# Altium project TTN_Gateway_V2.3.1.PrjPcb (part 2 of 2)

## Sheet processing.SchDoc: Processing
size A2 portrait; Organization: Tweetonig; Address1: Delftsestraat 11; DocumentNumber: 6; Revision: 1.0; SheetNumber: 6; SheetTotal: 9
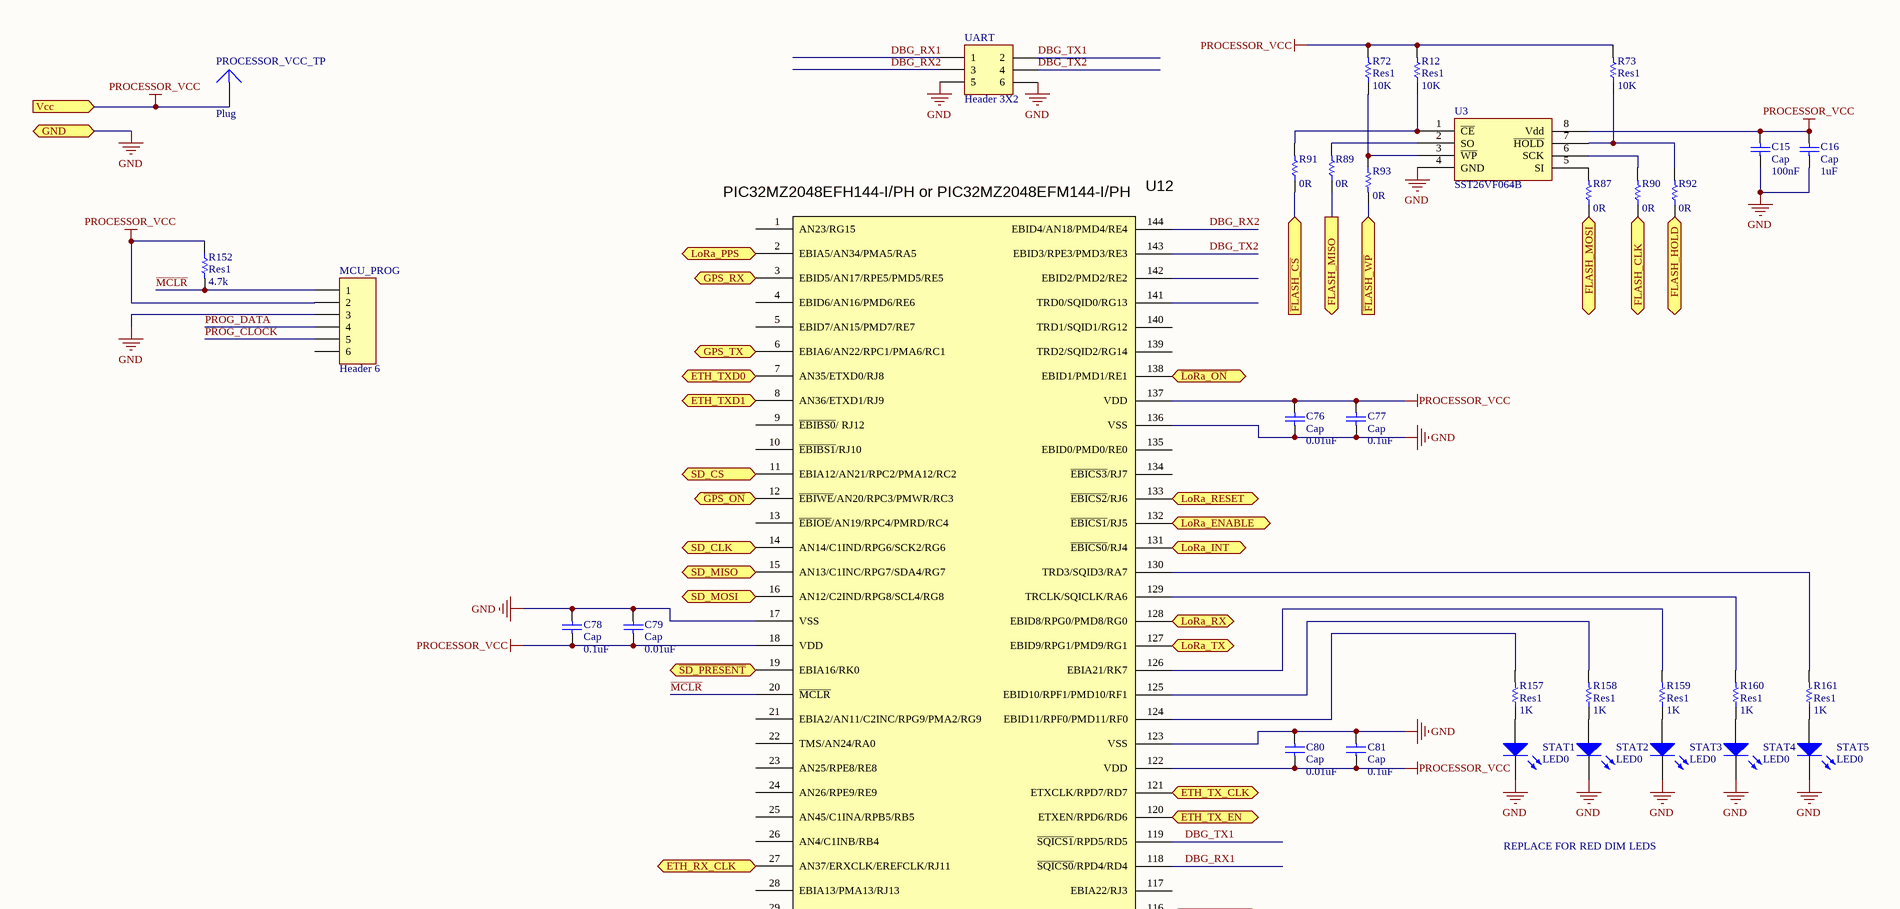
[diagram p7: processing.SchDoc, top]
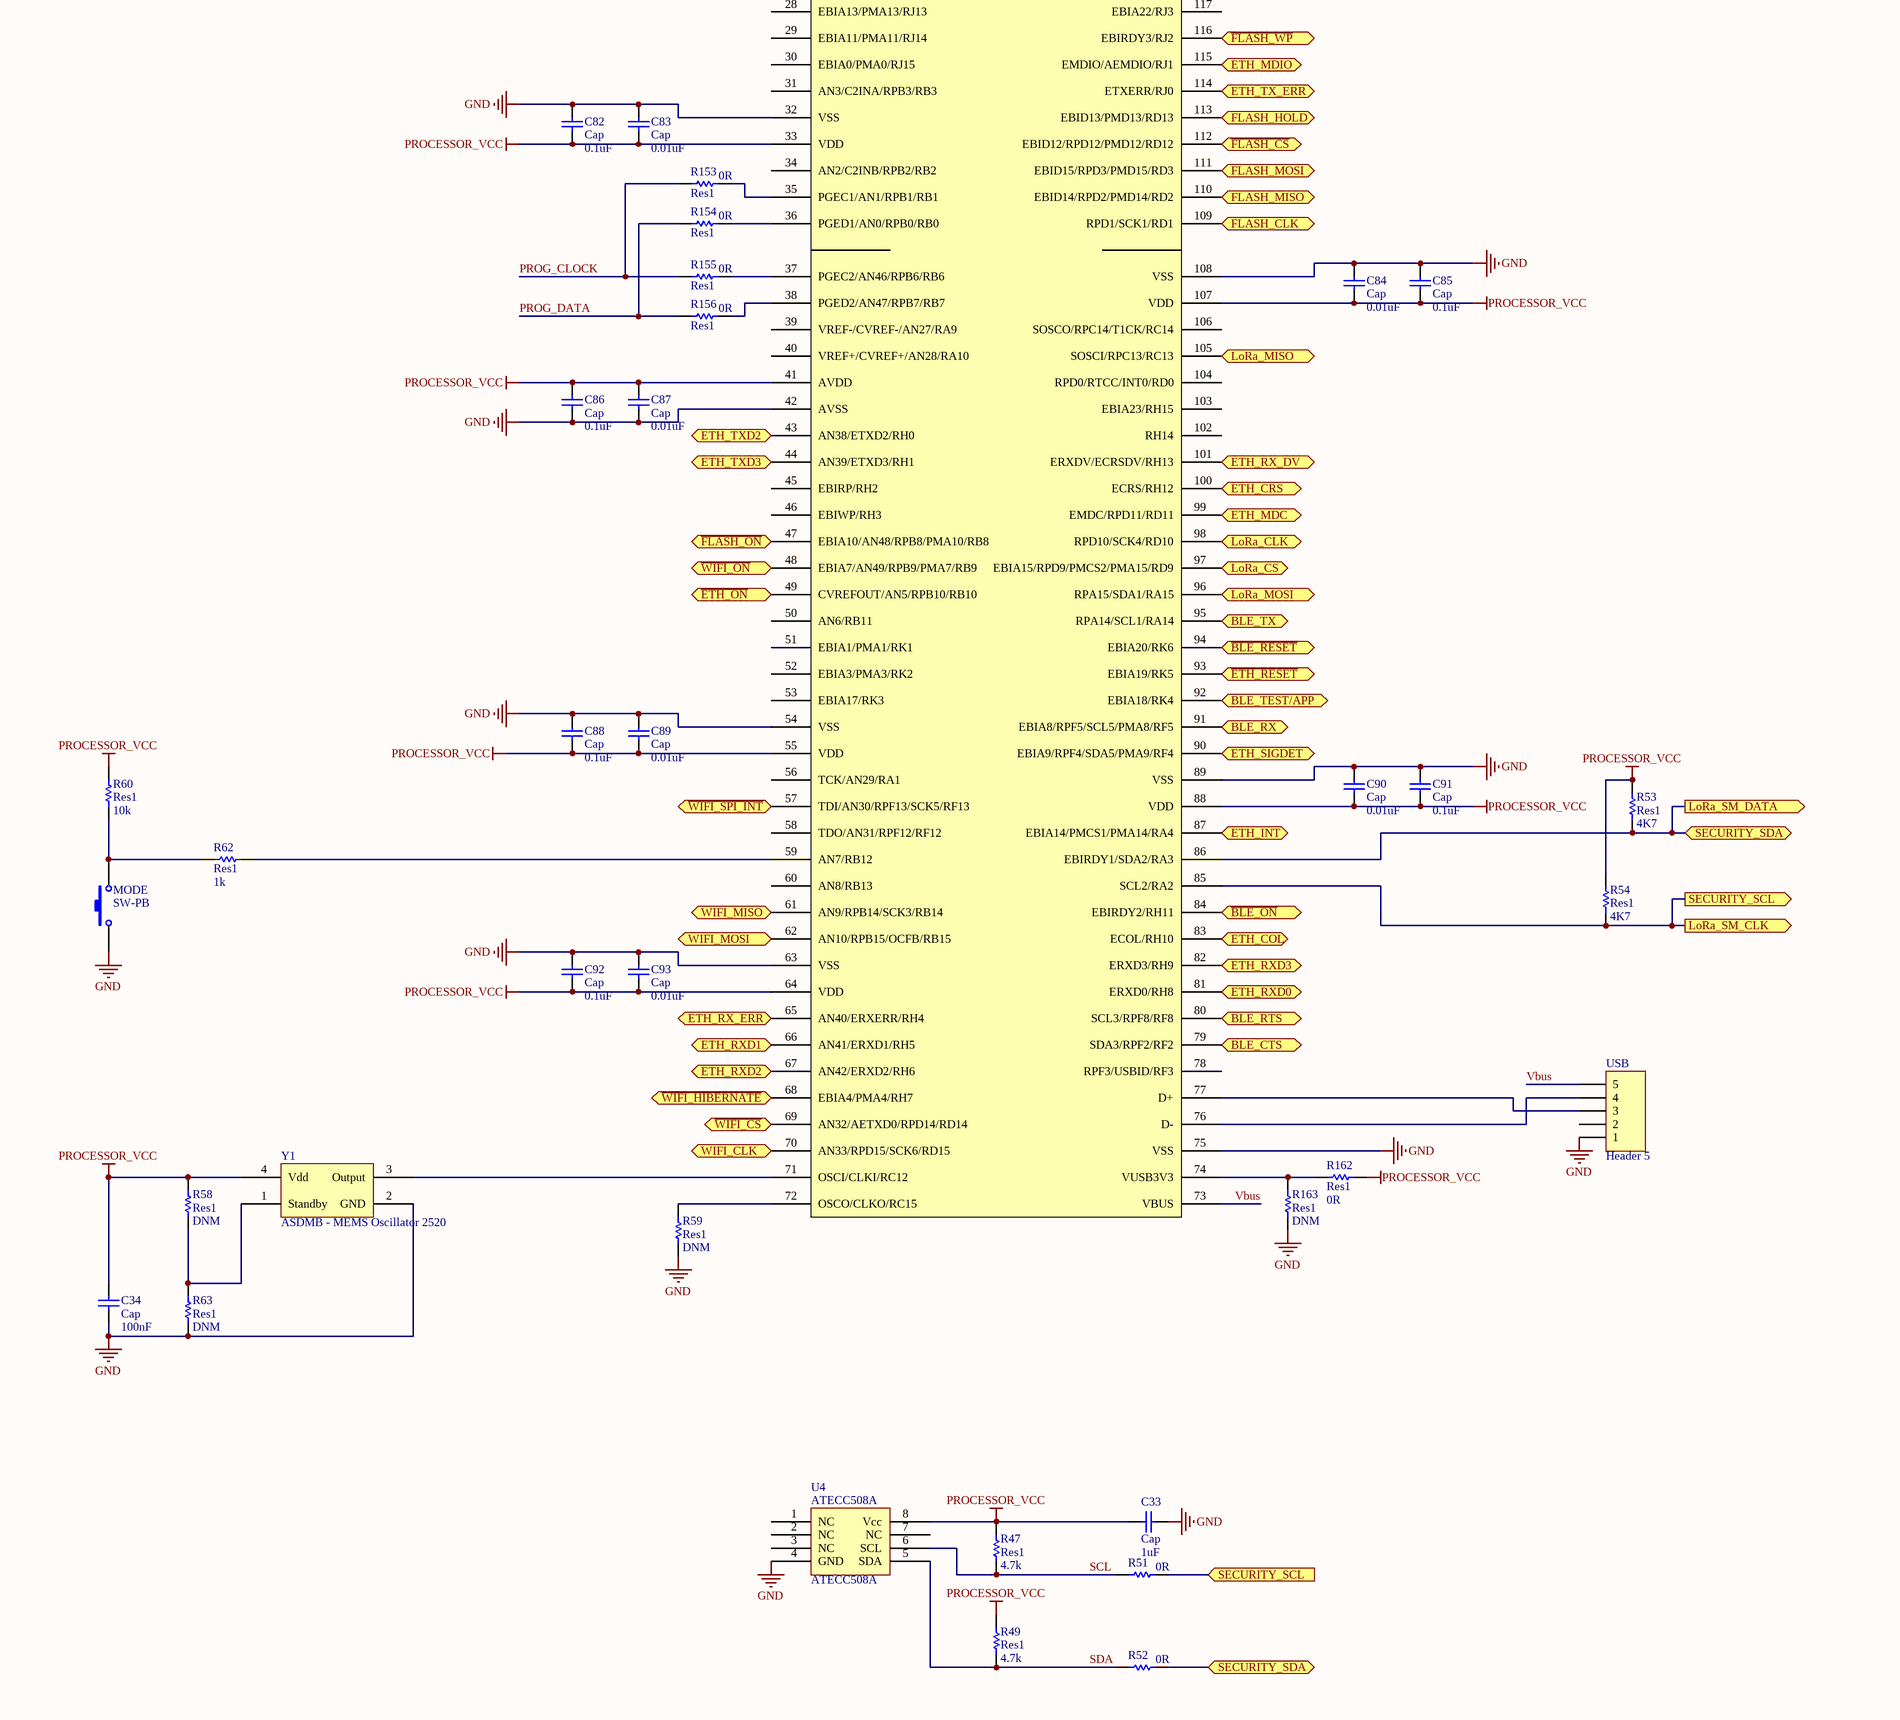
[diagram p8: processing.SchDoc, bottom]

### Parts
C15  Cap  value 100nF  [C0603]
C16  Cap  value 1uF  [C0603]
C33  Cap  value 1uF  [C0603]
C34  Cap  value 100nF  [6-0805_L]
C76  Cap  value 0.01uF  [C0603]
C77  Cap  value 0.1uF  [C0603]
C78  Cap  value 0.1uF  [C0603]
C79  Cap  value 0.01uF  [C0603]
C80  Cap  value 0.01uF  [C0603]
C81  Cap  value 0.1uF  [C0603]
C82  Cap  value 0.1uF  [C0603]
C83  Cap  value 0.01uF  [C0603]
C84  Cap  value 0.01uF  [C0603]
C85  Cap  value 0.1uF  [C0603]
C86  Cap  value 0.1uF  [C0603]
C87  Cap  value 0.01uF  [C0603]
C88  Cap  value 0.1uF  [C0603]
C89  Cap  value 0.01uF  [C0603]
C90  Cap  value 0.01uF  [C0603]
C91  Cap  value 0.1uF  [C0603]
C92  Cap  value 0.1uF  [C0603]
C93  Cap  value 0.01uF  [C0603]
MCU_PROG  Header 6  [HDR1X6]
MODE  SW-PB  [BUTTON]
PROCESSOR_VCC_TP  Plug  [PIN1]
R12  Res1  value 10K  [R0603]
R47  Res1  value 4.7k  [R0603]
R49  Res1  value 4.7k  [R0603]
R51  value 0R  [R0603]
R52  value 0R  [R0603]
R53  Res1  value 4K7  [R0603]
R54  Res1  value 4K7  [R0603]
R58  Res1  value DNM  [R0603]
R59  Res1  value DNM  [R0603]
R60  Res1  value 10k  [R0603]
R62  Res1  value 1k  [R0603]
R63  Res1  value DNM  [R0603]
R72  Res1  value 10K  [R0603]
R73  Res1  value 10K  [R0603]
R87  value 0R  [R0603]
R89  value 0R  [R0603]
R90  value 0R  [R0603]
R91  value 0R  [R0603]
R92  value 0R  [R0603]
R93  value 0R  [R0603]
R152  Res1  value 4.7k  [R0603]
R153  Res1  value 0R  [R0603]
R154  Res1  value 0R  [R0603]
R155  Res1  value 0R  [R0603]
R156  Res1  value 0R  [R0603]
R157  Res1  value 1K  [R0603]
R158  Res1  value 1K  [R0603]
R159  Res1  value 1K  [R0603]
R160  Res1  value 1K  [R0603]
R161  Res1  value 1K  [R0603]
R162  Res1  value 0R  [R0603]
R163  Res1  value DNM  [R0603]
STAT1  LED0  [C0603]
STAT2  LED0  [C0603]
STAT3  LED0  [C0603]
STAT4  LED0  [C0603]
STAT5  LED0  [C0603]
U3  SST26VF064B  [SOIJ-SM8_M]
U4  ATECC508A  [UDFN-MU8-non-thermal]
U12  PIC32MZ2048EFH144-I/PH or PIC32MZ2048EFM144-I/PH  [MCHP-TQFP-PH144_M]
UART  Header 3X2  [HDR2X3]
USB  Header 5  [Vertical MicroUSB]
Y1  ASDMB - MEMS Oscillator 2520  [BT-XTAL_2520]

### Ports
BLE_CTS (out), BLE_RTS (in), BLE_RX (out), BLE_TEST/APP (out), BLE_TX (in), ETH_COL (in), ETH_CRS (in), ETH_INT (in), ETH_MDC (out), ETH_MDIO, ETH_RX_CLK (in), ETH_RX_DV (in), ETH_RX_ERR (in), ETH_RXD0 (in), ETH_RXD1 (in), ETH_RXD2 (in), ETH_RXD3 (in), ETH_SIGDET (in), ETH_TX_CLK (in), ETH_TX_EN (out), ETH_TX_ERR (out), ETH_TXD0 (out), ETH_TXD1 (out), ETH_TXD2 (out), ETH_TXD3 (out), FLASH_CLK (in), FLASH_CLK (out), FLASH_HOLD (in), FLASH_HOLD (out), FLASH_MISO (in), FLASH_MISO (out), FLASH_MOSI (in), FLASH_MOSI (out), GND (bidir), GPS_RX (out), GPS_TX (in), LoRa_CLK (out), LoRa_CS (out), LoRa_ENABLE (out), LoRa_INT (in), LoRa_MISO (in), LoRa_MOSI (out), LoRa_PPS (out), LoRa_RESET (out), LoRa_RX (out), LoRa_SM_CLK (out), LoRa_SM_DATA (out), LoRa_TX (in), SD_CLK (out), SD_CS (out), SD_MISO (in), SD_MOSI (out), SECURITY_SCL (in), SECURITY_SCL (out), SECURITY_SDA (bidir), Vcc (in), WIFI_CLK (out), WIFI_MISO (in), WIFI_MOSI (out), ~{BLE_ON} (out), ~{BLE_RESET} (out), ~{ETH_ON} (in), ~{ETH_RESET} (out), ~{FLASH_CS} (in), ~{FLASH_CS} (out), ~{FLASH_ON} (in), ~{FLASH_WP} (in), ~{FLASH_WP} (out), ~{GPS_ON} (out), ~{LoRa_ON} (out), ~{SD_PRESENT} (in), ~{WIFI_CS} (out), ~{WIFI_HIBERNATE} (out), ~{WIFI_ON} (in), ~{WIFI_SPI_INT} (in)

### Nets
GND: C15.1 C16.1 C33.1 C34.1 C76.2 C77.2 C78.2 C79.2 C80.2 C81.2 C82.2 C83.2 C84.2 C85.2 C86.1 C87.1 C88.2 C89.2 C90.2 C91.2 C92.2 C93.2 MCU_PROG.3 MODE.1 R59.1 R63.1 R163.1 STAT1.2(K) STAT2.2(K) STAT3.2(K) STAT4.2(K) STAT5.2(K) U3.4(GND) U4.4(GND) U12.17(VSS) U12.32(VSS) U12.42(AVSS) U12.54(VSS) U12.63(VSS) U12.75(VSS) U12.89(VSS) U12.108(VSS) U12.123(VSS) U12.136(VSS) UART.5 UART.6 USB.1 Y1.2(GND) ; port GND
PROCESSOR_VCC: C15.2 C16.2 C33.2 C34.2 C76.1 C77.1 C78.1 C79.1 C80.1 C81.1 C82.1 C83.1 C84.1 C85.1 C86.2 C87.2 C88.1 C89.1 C90.1 C91.1 C92.1 C93.1 MCU_PROG.2 PROCESSOR_VCC_TP.1 R12.2 R47.1 R49.1 R53.1 R54.1 R58.2 R60.1 R72.2 R73.2 R152.1 R162.2 U3.8(Vdd) U4.8(Vcc) U12.18(VDD) U12.33(VDD) U12.41(AVDD) U12.55(VDD) U12.64(VDD) U12.88(VDD) U12.107(VDD) U12.122(VDD) U12.137(VDD) Y1.4(Vdd) ; port Vcc
~{MCLR}: MCU_PROG.1 R152.2 U12.20(~{MCLR})
DBG_RX1: U12.118(~{SQICS0}/RPD4/RD4) UART.1
DBG_RX2: U12.144(EBID4/AN18/PMD4/RE4) UART.3
DBG_TX1: U12.119(~{SQICS1}/RPD5/RD5) UART.2
DBG_TX2: U12.143(EBID3/RPE3/PMD3/RE3) UART.4
PROG_CLOCK: MCU_PROG.5 R153.2 R155.2
PROG_DATA: MCU_PROG.4 R154.2 R156.2
SCL: R47.2 R51.1 U4.6(SCL)
SDA: R49.2 R52.1 U4.5(SDA)
Vbus: U12.73(VBUS) USB.5
NetMODE_2: MODE.2 R60.2 R62.1
NetR12_1: R12.1 R91.2 U3.1(~{CE})
NetR15_1: U12.48(EBIA7/AN49/RPB9/PMA7/RB9) ; port ~{WIFI_ON}
NetR17_1: U12.47(EBIA10/AN48/RPB8/PMA10/RB8) ; port ~{FLASH_ON}
NetR19_1: U12.138(EBID1/PMD1/RE1) ; port ~{LoRa_ON}
NetR21_1: U12.84(EBIRDY2/RH11) ; port ~{BLE_ON}
NetR23_1: U12.49(CVREFOUT/AN5/RPB10/RB10) ; port ~{ETH_ON}
NetR36_1: U12.12(~{EBIWE}/AN20/RPC3/PMWR/RC3) ; port ~{GPS_ON}
NetR37_1: U12.6(EBIA6/AN22/RPC1/PMA6/RC1) ; port GPS_TX
NetR38_1: U12.3(EBID5/AN17/RPE5/PMD5/RE5) ; port GPS_RX
NetR51_2: R51.2 R54.2 U12.85(SCL2/RA2) ; port LoRa_SM_CLK, port SECURITY_SCL
NetR52_2: R52.2 R53.2 U12.86(EBIRDY1/SDA2/RA3) ; port LoRa_SM_DATA, port SECURITY_SDA
NetR58_1: R58.1 R63.2 Y1.1(Standby)
NetR59_2: R59.2 U12.72(OSCO/CLKO/RC15)
NetR62_2: R62.2 U12.59(AN7/RB12)
NetR72_1: R72.1 R93.1 U3.3(~{WP})
NetR73_1: R73.1 R92.2 U3.7(~{HOLD})
NetR75_2: U12.62(AN10/RPB15/OCFB/RB15) ; port WIFI_MOSI
NetR76_2: U12.61(AN9/RPB14/SCK3/RB14) ; port WIFI_MISO
NetR77_2: U12.70(AN33/RPD15/SCK6/RD15) ; port WIFI_CLK
NetR78_2: U12.69(AN32/AETXD0/RPD14/RD14) ; port ~{WIFI_CS}
NetR80_2: U12.68(EBIA4/PMA4/RH7) ; port ~{WIFI_HIBERNATE}
NetR81_2: U12.57(TDI/AN30/RPF13/SCK5/RF13) ; port ~{WIFI_SPI_INT}
NetR82_2: U12.16(AN12/C2IND/RPG8/SCL4/RG8) ; port SD_MOSI
NetR83_2: U12.15(AN13/C1INC/RPG7/SDA4/RG7) ; port SD_MISO
NetR84_2: U12.14(AN14/C1IND/RPG6/SCK2/RG6) ; port SD_CLK
NetR85_2: U12.11(EBIA12/AN21/RPC2/PMA12/RC2) ; port SD_CS
NetR86_2: U12.19(EBIA16/RK0) ; port ~{SD_PRESENT}
NetR87_1: R87.1 U12.111(EBID15/RPD3/PMD15/RD3) ; port FLASH_MOSI
NetR87_2: R87.2 U3.5(SI)
NetR89_1: R89.1 U12.110(EBID14/RPD2/PMD14/RD2) ; port FLASH_MISO
NetR89_2: R89.2 U3.2(SO)
NetR90_1: R90.1 U12.109(RPD1/SCK1/RD1) ; port FLASH_CLK
NetR90_2: R90.2 U3.6(SCK)
NetR91_1: R91.1 U12.112(EBID12/RPD12/PMD12/RD12) ; port ~{FLASH_CS}
NetR92_1: R92.1 U12.113(EBID13/PMD13/RD13) ; port FLASH_HOLD
NetR93_2: R93.2 U12.116(EBIRDY3/RJ2) ; port ~{FLASH_WP}
NetR94_2: U12.96(RPA15/SDA1/RA15) ; port LoRa_MOSI
NetR95_2: U12.105(SOSCI/RPC13/RC13) ; port LoRa_MISO
NetR96_2: U12.98(RPD10/SCK4/RD10) ; port LoRa_CLK
NetR97_2: U12.97(EBIA15/RPD9/PMCS2/PMA15/RD9) ; port LoRa_CS
NetR100_2: U12.128(EBID8/RPG0/PMD8/RG0) ; port LoRa_RX
NetR102_2: U12.127(EBID9/RPG1/PMD9/RG1) ; port LoRa_TX
NetR103_2: U12.132(~{EBICS1}/RJ5) ; port LoRa_ENABLE
NetR104_2: U12.131(~{EBICS0}/RJ4) ; port LoRa_INT
NetR105_2: U12.2(EBIA5/AN34/PMA5/RA5) ; port LoRa_PPS
NetR106_2: U12.133(~{EBICS2}/RJ6) ; port LoRa_RESET
NetR107_2: U12.91(EBIA8/RPF5/SCL5/PMA8/RF5) ; port BLE_RX
NetR108_2: U12.95(RPA14/SCL1/RA14) ; port BLE_TX
NetR109_2: U12.94(EBIA20/RK6) ; port ~{BLE_RESET}
NetR111_2: U12.80(SCL3/RPF8/RF8) ; port BLE_RTS
NetR112_2: U12.79(SDA3/RPF2/RF2) ; port BLE_CTS
NetR113_2: U12.92(EBIA18/RK4) ; port BLE_TEST/APP
NetR114_2: U12.100(ECRS/RH12) ; port ETH_CRS
NetR115_2: U12.83(ECOL/RH10) ; port ETH_COL
NetR116_2: U12.44(AN39/ETXD3/RH1) ; port ETH_TXD3
NetR117_2: U12.43(AN38/ETXD2/RH0) ; port ETH_TXD2
NetR118_2: U12.8(AN36/ETXD1/RJ9) ; port ETH_TXD1
NetR119_2: U12.7(AN35/ETXD0/RJ8) ; port ETH_TXD0
NetR120_2: U12.120(ETXEN/RPD6/RD6) ; port ETH_TX_EN
NetR121_2: U12.121(ETXCLK/RPD7/RD7) ; port ETH_TX_CLK
NetR122_2: U12.114(ETXERR/RJ0) ; port ETH_TX_ERR
NetR123_2: U12.65(AN40/ERXERR/RH4) ; port ETH_RX_ERR
NetR124_2: U12.27(AN37/ERXCLK/EREFCLK/RJ11) ; port ETH_RX_CLK
NetR125_2: U12.101(ERXDV/ECRSDV/RH13) ; port ETH_RX_DV
NetR126_2: U12.81(ERXD0/RH8) ; port ETH_RXD0
NetR127_2: U12.66(AN41/ERXD1/RH5) ; port ETH_RXD1
NetR128_2: U12.67(AN42/ERXD2/RH6) ; port ETH_RXD2
NetR129_2: U12.82(ERXD3/RH9) ; port ETH_RXD3
NetR130_2: U12.99(EMDC/RPD11/RD11) ; port ETH_MDC
NetR132_2: U12.115(EMDIO/AEMDIO/RJ1) ; port ETH_MDIO
NetR133_2: U12.87(EBIA14/PMCS1/PMA14/RA4) ; port ETH_INT
NetR134_2: U12.93(EBIA19/RK5) ; port ~{ETH_RESET}
NetR135_2: U12.90(EBIA9/RPF4/SDA5/PMA9/RF4) ; port ETH_SIGDET
NetR153_1: R153.1 U12.35(PGEC1/AN1/RPB1/RB1)
NetR154_1: R154.1 U12.36(PGED1/AN0/RPB0/RB0)
NetR155_1: R155.1 U12.37(PGEC2/AN46/RPB6/RB6)
NetR156_1: R156.1 U12.38(PGED2/AN47/RPB7/RB7)
NetR157_1: R157.1 STAT1.1(A)
NetR157_2: R157.2 U12.124(EBID11/RPF0/PMD11/RF0)
NetR158_1: R158.1 STAT2.1(A)
NetR158_2: R158.2 U12.125(EBID10/RPF1/PMD10/RF1)
NetR159_1: R159.1 STAT3.1(A)
NetR159_2: R159.2 U12.126(EBIA21/RK7)
NetR160_1: R160.1 STAT4.1(A)
NetR160_2: R160.2 U12.129(TRCLK/SQICLK/RA6)
NetR161_1: R161.1 STAT5.1(A)
NetR161_2: R161.2 U12.130(TRD3/SQID3/RA7)
NetR162_1: R162.1 R163.2 U12.74(VUSB3V3)
NetU12_71: U12.71(OSCI/CLKI/RC12) Y1.3(Output)
NetU12_76: U12.76(D-) USB.4
NetU12_77: U12.77(D+) USB.3

Not connected (* = marked no-connect by the designer): MCU_PROG 6; U4 1(NC) 2(NC) 3(NC) 7(NC); U12 1(AN23/RG15) 4(EBID6/AN16/PMD6/RE6) 5(EBID7/AN15/PMD7/RE7) 9(~{EBIBS0}/_RJ12) 10(~{EBIBS1}/RJ10) 13(~{EBIOE}/AN19/RPC4/PMRD/RC4) 21(EBIA2/AN11/C2INC/RPG9/PMA2/RG9) 22(TMS/AN24/RA0) 23(AN25/RPE8/RE8) 24(AN26/RPE9/RE9) 25(AN45/C1INA/RPB5/RB5) 26(AN4/C1INB/RB4) 28(EBIA13/PMA13/RJ13) 29(EBIA11/PMA11/RJ14) 30(EBIA0/PMA0/RJ15) 31(AN3/C2INA/RPB3/RB3) 34(AN2/C2INB/RPB2/RB2) 39(VREF-/CVREF-/AN27/RA9) 40(VREF+/CVREF+/AN28/RA10) 45(EBIRP/RH2) 46(EBIWP/RH3) 50(AN6/RB11) 51(EBIA1/PMA1/RK1) 52(EBIA3/PMA3/RK2) 53(EBIA17/RK3) 56(TCK/AN29/RA1) 58(TDO/AN31/RPF12/RF12) 60(AN8/RB13) 78(RPF3/USBID/RF3) 102(RH14) 103(EBIA23/RH15) 104(RPD0/RTCC/INT0/RD0) 106(SOSCO/RPC14/T1CK/RC14) 117(EBIA22/RJ3) 134(~{EBICS3}/RJ7) 135(EBID0/PMD0/RE0) 139(TRD2/SQID2/RG14) 140(TRD1/SQID1/RG12) 141(TRD0/SQID0/RG13) 142(EBID2/PMD2/RE2); USB 2

### Notes on the sheet
- REPLACE FOR RED DIM LEDS
- Title
- The Things Products
- Size:
- Date:
- Project:
- A3
- Number:
- Time:
- Revision:
- Sheet
- of
- File:

### Library data of the parts
C15 C16 C33 C34 C76-C93 = Cap: Capacitor; Published: 8-Jun-2000; LatestRevisionDate: 17-Jul-2002; LatestRevisionNote: Re-released for DXP Platform.; PackageReference: RAD-0.3; Publisher: Altium Limited; PackageDescription: Radial Cap, Thru-Hole; 2 Leads; 0.3 in Pin Spacing
MCU_PROG = Header 6: Header, 6-Pin; LatestRevisionDate: 17-Jul-2002; LatestRevisionNote: Re-released for DXP Platform.; Publisher: Altium Limited
MODE = SW-PB: Switch; Published: 24-Mar-1999; LatestRevisionDate: 17-Jul-2002; LatestRevisionNote: Re-released for DXP Platform.; PackageReference: SPST-2; Publisher: Altium Limited; PackageDescription: Switch; 2 Leads
R12 R47 R49 R51-R54 R58-R60 R62 R63 R72 R73 R87 R89-R93 R152-R163 = Res1: Resistor; Published: 8-Jun-2000; LatestRevisionDate: 17-Jul-2002; LatestRevisionNote: Re-released for DXP Platform.; PackageReference: AXIAL-0.3; Publisher: Altium Limited; PackageDescription: Axial Device, Thru-Hole; 2 Leads; 0.3 in Pin Spacing
STAT1-STAT5 = LED0: Typical INFRARED GaAs LED; Published: 8-Jun-2000; LatestRevisionDate: 08-Jul-2005; LatestRevisionNote: Mech Layer 1 removed.; PackageReference: LED-0; Publisher: Altium Limited; PackageDescription: LED; 2 Leads
U3 = SST26VF064B: SST26VF064B Microchip SPI Flash Memory 64Mbit
U12 = PIC32MZ2056ECE144_144TQFP_Chicagoland: PIC32MZ2056ECE144 Chicagoland; Manufacturer: Microchip
UART = Header 3X2: Header, 3-Pin, Dual row; LatestRevisionDate: 17-Jul-2002; LatestRevisionNote: Re-released for DXP Platform.; Publisher: Altium Limited
USB = Header 5: Header, 5-Pin; LatestRevisionDate: 17-Jul-2002; LatestRevisionNote: Re-released for DXP Platform.; Publisher: Altium Limited
PROCESSOR_VCC_TP = Plug: LatestRevisionDate: 17-Jul-2002; LatestRevisionNote: Re-released for DXP Platform.; Publisher: Altium Limited

## Sheet bee.SchDoc: Bee connection
size A4; DocumentNumber: 9; SheetNumber: 9; SheetTotal: 9
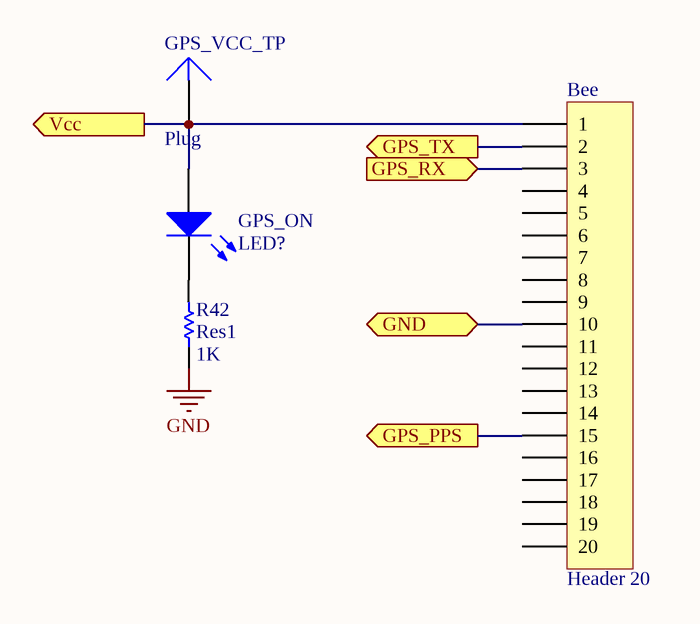
[diagram p9: bee.SchDoc]

### Parts
Bee  Header 20  [BeeSlot]
GPS_ON  LED?  [C0603]
GPS_VCC_TP  Plug  [PIN1]
R42  Res1  value 1K  [R0603]

### Ports
GND, GPS_PPS (out), GPS_RX (in), GPS_TX (out), Vcc (out)

### Nets
GND: Bee.10 R42.1 ; port GND
GPS_PPS_OUTPUT: Bee.15 ; port GPS_PPS
NetBee_1: Bee.1 GPS_ON.1(A) GPS_VCC_TP.1 ; port Vcc
NetBee_2: Bee.2 ; port GPS_TX
NetBee_3: Bee.3 ; port GPS_RX
NetGPS_ON_2: GPS_ON.2(K) R42.2

Not connected (* = marked no-connect by the designer): Bee 4 5 6 7 8 9 11 12 13 14 16 17 18 19 20

### Notes on the sheet
- Title
- Size:
- Date:
- A4
- Number:
- Time:
- Revision:
- Sheet
- of
- The Things Products
- Project:
- File:

### Library data of the parts
Bee = Header 20: Header, 20-Pin; LatestRevisionDate: 17-Jul-2002; LatestRevisionNote: Re-released for DXP Platform.; Publisher: Altium Limited
GPS_ON = LED0: Typical INFRARED GaAs LED; Published: 8-Jun-2000; LatestRevisionDate: 08-Jul-2005; LatestRevisionNote: Mech Layer 1 removed.; PackageReference: LED-0; Publisher: Altium Limited; PackageDescription: LED; 2 Leads
R42 = Res1: Resistor; Published: 8-Jun-2000; LatestRevisionDate: 17-Jul-2002; LatestRevisionNote: Re-released for DXP Platform.; PackageReference: AXIAL-0.3; Publisher: Altium Limited; PackageDescription: Axial Device, Thru-Hole; 2 Leads; 0.3 in Pin Spacing
GPS_VCC_TP = Plug: LatestRevisionDate: 17-Jul-2002; LatestRevisionNote: Re-released for DXP Platform.; Publisher: Altium Limited

## Nets that join several sheets
3.3V_Rail: toplevel (14 pins), power (17 pins)
ETH_VCC: toplevel (C23.2 Q5.1), ethernet (20 pins)
GND: power (24 pins), wifi (17 pins), memory (C17.1 C18.1 R26.1 U5.GND), ethernet (39 pins), lora (30 pins), bluetooth (6 pins), processing (48 pins), bee (Bee.10 R42.1)
PROCESSOR_VCC: toplevel (F6.2 R151.2), processing (47 pins)
BLE_CTS: toplevel (R112.1), bluetooth (BLE_DBG.5 U13.11)
BLE_RTS: toplevel (R111.1), bluetooth (BLE_DBG.4 U13.9)
BLE_RX: toplevel (R107.1), bluetooth (BLE_DBG.1 U13.7)
BLE_TX: toplevel (R108.1), bluetooth (BLE_DBG.6 U13.8)
BLE_VCC: toplevel (C22.2 Q4.1), bluetooth (8 pins)
GPS_PPS_OUTPUT: toplevel (PPS_INJECT.1), bee (Bee.15)
LoRa_PPS_INPUT: toplevel (PPS_INJECT.2), lora (U11.5)
MEMORY_VCC: toplevel (C20.2 Q2.1), memory (7 pins)
NetBee_1: toplevel (C32.2 Q6.1), bee (Bee.1 GPS_ON.1 GPS_VCC_TP.1)
NetBee_2: toplevel (R37.2), bee (Bee.2)
NetBee_3: toplevel (R38.2), bee (Bee.3)
NetC21_2: toplevel (C21.2 Q3.1), lora (L1.1 LORA_ON.1 LoRa_VCC_TP.1)
NetD16_3: toplevel (R134.1), ethernet (D16.3)
NetR9_1: toplevel (R78.1), wifi (R9.1 U2.23)
NetR10_1: toplevel (R80.1), wifi (R10.1 U2.19)
NetR11_2: toplevel (R76.1), wifi (R11.2 U2.14)
NetR14_2: toplevel (R86.1), memory (R14.2)
NetR15_1: toplevel (R15.1 R16.2), processing (U12.48)
NetR17_1: toplevel (R17.1 R18.2), processing (U12.47)
NetR19_1: toplevel (R19.1 R20.2), processing (U12.138)
NetR21_1: toplevel (R21.1 R22.2), processing (U12.84)
NetR23_1: toplevel (R23.1 R24.2), processing (U12.49)
NetR36_1: toplevel (R36.1 R39.1), processing (U12.12)
NetR37_1: toplevel (R37.1), processing (U12.6)
NetR38_1: toplevel (R38.1), processing (U12.3)
NetR40_1: toplevel (R109.1), bluetooth (R40.1 U13.10)
NetR41_1: toplevel (R85.1), memory (R41.1 U5.\C\S\)
NetR43_1: toplevel (R97.1), lora (R43.1 U11.49)
NetR48_2: toplevel (R102.1), lora (R48.2 R64.2)
NetR50_2: toplevel (R100.1), lora (R50.2 R65.1)
NetR51_2: toplevel (R99.2), processing (R51.2 R54.2 U12.85)
NetR52_2: toplevel (R98.2), processing (R52.2 R53.2 U12.86)
NetR55_2: toplevel (R114.1), ethernet (R55.2 U10.38)
NetR56_2: toplevel (R122.1), ethernet (R56.2 U10.34)
NetR71_1: toplevel (R113.1), bluetooth (R71.1 U13.16)
NetR75_1: toplevel (R75.1), wifi (U2.22)
NetR75_2: toplevel (R75.2), processing (U12.62)
NetR76_2: toplevel (R76.2), processing (U12.61)
NetR77_1: toplevel (R77.1), wifi (U2.13)
NetR77_2: toplevel (R77.2), processing (U12.70)
NetR78_2: toplevel (R78.2), processing (U12.69)
NetR80_2: toplevel (R80.2), processing (U12.68)
NetR81_1: toplevel (R81.1), wifi (U2.20)
NetR81_2: toplevel (R81.2), processing (U12.57)
NetR82_1: toplevel (R82.1), memory (U5.MOSI)
NetR82_2: toplevel (R82.2), processing (U12.16)
NetR83_1: toplevel (R83.1), memory (U5.MISO)
NetR83_2: toplevel (R83.2), processing (U12.15)
NetR84_1: toplevel (R84.1), memory (U5.CLK)
NetR84_2: toplevel (R84.2), processing (U12.14)
NetR85_2: toplevel (R85.2), processing (U12.11)
NetR86_2: toplevel (R86.2), processing (U12.19)
NetR94_1: toplevel (R94.1), lora (U11.45)
NetR94_2: toplevel (R94.2), processing (U12.96)
NetR95_1: toplevel (R95.1), lora (U11.47)
NetR95_2: toplevel (R95.2), processing (U12.105)
NetR96_1: toplevel (R96.1), lora (U11.51)
NetR96_2: toplevel (R96.2), processing (U12.98)
NetR97_2: toplevel (R97.2), processing (U12.97)
NetR98_1: toplevel (R98.1), lora (U11.32)
NetR99_1: toplevel (R99.1), lora (U11.30)
NetR100_2: toplevel (R100.2), processing (U12.128)
NetR102_2: toplevel (R102.2), processing (U12.127)
NetR103_1: toplevel (R103.1), lora (U11.20)
NetR103_2: toplevel (R103.2), processing (U12.132)
NetR104_1: toplevel (R104.1), lora (U11.3)
NetR104_2: toplevel (R104.2), processing (U12.131)
NetR105_2: toplevel (R105.2), processing (U12.2)
NetR106_1: toplevel (R106.1), lora (U11.22)
NetR106_2: toplevel (R106.2), processing (U12.133)
NetR107_2: toplevel (R107.2), processing (U12.91)
NetR108_2: toplevel (R108.2), processing (U12.95)
NetR109_2: toplevel (R109.2), processing (U12.94)
NetR111_2: toplevel (R111.2), processing (U12.80)
NetR112_2: toplevel (R112.2), processing (U12.79)
NetR113_2: toplevel (R113.2), processing (U12.92)
NetR114_2: toplevel (R114.2), processing (U12.100)
NetR115_1: toplevel (R115.1), ethernet (U10.15)
NetR115_2: toplevel (R115.2), processing (U12.83)
NetR116_1: toplevel (R116.1), ethernet (U10.37)
NetR116_2: toplevel (R116.2), processing (U12.44)
NetR117_1: toplevel (R117.1), ethernet (U10.35)
NetR117_2: toplevel (R117.2), processing (U12.43)
NetR118_1: toplevel (R118.1), ethernet (U10.32)
NetR118_2: toplevel (R118.2), processing (U12.8)
NetR119_1: toplevel (R119.1), ethernet (U10.31)
NetR119_2: toplevel (R119.2), processing (U12.7)
NetR120_1: toplevel (R120.1), ethernet (U10.30)
NetR120_2: toplevel (R120.2), processing (U12.120)
NetR121_1: toplevel (R121.1), ethernet (R142.1)
NetR121_2: toplevel (R121.2), processing (U12.121)
NetR122_2: toplevel (R122.2), processing (U12.114)
NetR123_1: toplevel (R123.1), ethernet (R149.1)
NetR123_2: toplevel (R123.2), processing (U12.65)
NetR124_1: toplevel (R124.1), ethernet (R143.1)
NetR124_2: toplevel (R124.2), processing (U12.27)
NetR125_1: toplevel (R125.1), ethernet (R148.1)
NetR125_2: toplevel (R125.2), processing (U12.101)
NetR126_1: toplevel (R126.1), ethernet (R144.1)
NetR126_2: toplevel (R126.2), processing (U12.81)
NetR127_1: toplevel (R127.1), ethernet (R145.1)
NetR127_2: toplevel (R127.2), processing (U12.66)
NetR128_1: toplevel (R128.1), ethernet (R146.1)
NetR128_2: toplevel (R128.2), processing (U12.67)
NetR129_1: toplevel (R129.1), ethernet (R147.1)
NetR129_2: toplevel (R129.2), processing (U12.82)
NetR130_1: toplevel (R130.1), ethernet (U10.17)
NetR130_2: toplevel (R130.2), processing (U12.99)
NetR132_1: toplevel (R132.1), ethernet (R150.1 U10.16)
NetR132_2: toplevel (R132.2), processing (U12.115)
NetR133_1: toplevel (R133.1), ethernet (R137.1 U10.44)
NetR133_2: toplevel (R133.2), processing (U12.87)
NetR134_2: toplevel (R134.2), processing (U12.93)
NetR135_1: toplevel (R135.1), ethernet (U10.48)
NetR135_2: toplevel (R135.2), processing (U12.90)
WIFI_VCC: toplevel (C19.2 Q1.1), wifi (13 pins)